# Altium schematic sheet layout.SchDoc
size A4
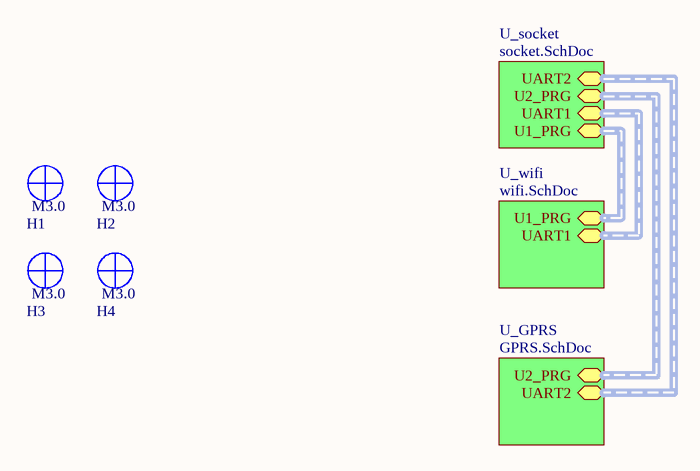
[diagram p0: layout.SchDoc]

## Parts
H1  M3.0  [SCREW_HOLE_3.5]  (value not drawn)  (no BOM)
H2  M3.0  [SCREW_HOLE_3.5]  (value not drawn)  (no BOM)
H3  M3.0  [SCREW_HOLE_3.5]  (value not drawn)  (no BOM)
H4  M3.0  [SCREW_HOLE_3.5]  (value not drawn)  (no BOM)

## Sub-sheets
U_GPRS = GPRS.SchDoc: U2_PRG (harness U2_PRG), UART2 (harness UART2)
U_socket = socket.SchDoc: UART2 (harness UART2), U2_PRG (harness U2_PRG), UART1 (harness UART1), U1_PRG (harness U1_PRG)
U_wifi = wifi.SchDoc: U1_PRG (harness U1_PRG), UART1 (harness UART1)

## Buses and harness runs
harness sheet U_GPRS/U2_PRG = sheet U_socket/U2_PRG
harness sheet U_GPRS/UART2 = sheet U_socket/UART2
harness sheet U_socket/U1_PRG = sheet U_wifi/U1_PRG
harness sheet U_socket/UART1 = sheet U_wifi/UART1

## Library data of the parts
H1-H4 = SCRE_HOLE_3.2: Screw hole for M3.0